# EAGLE design untitled (EAGLE 5.06)
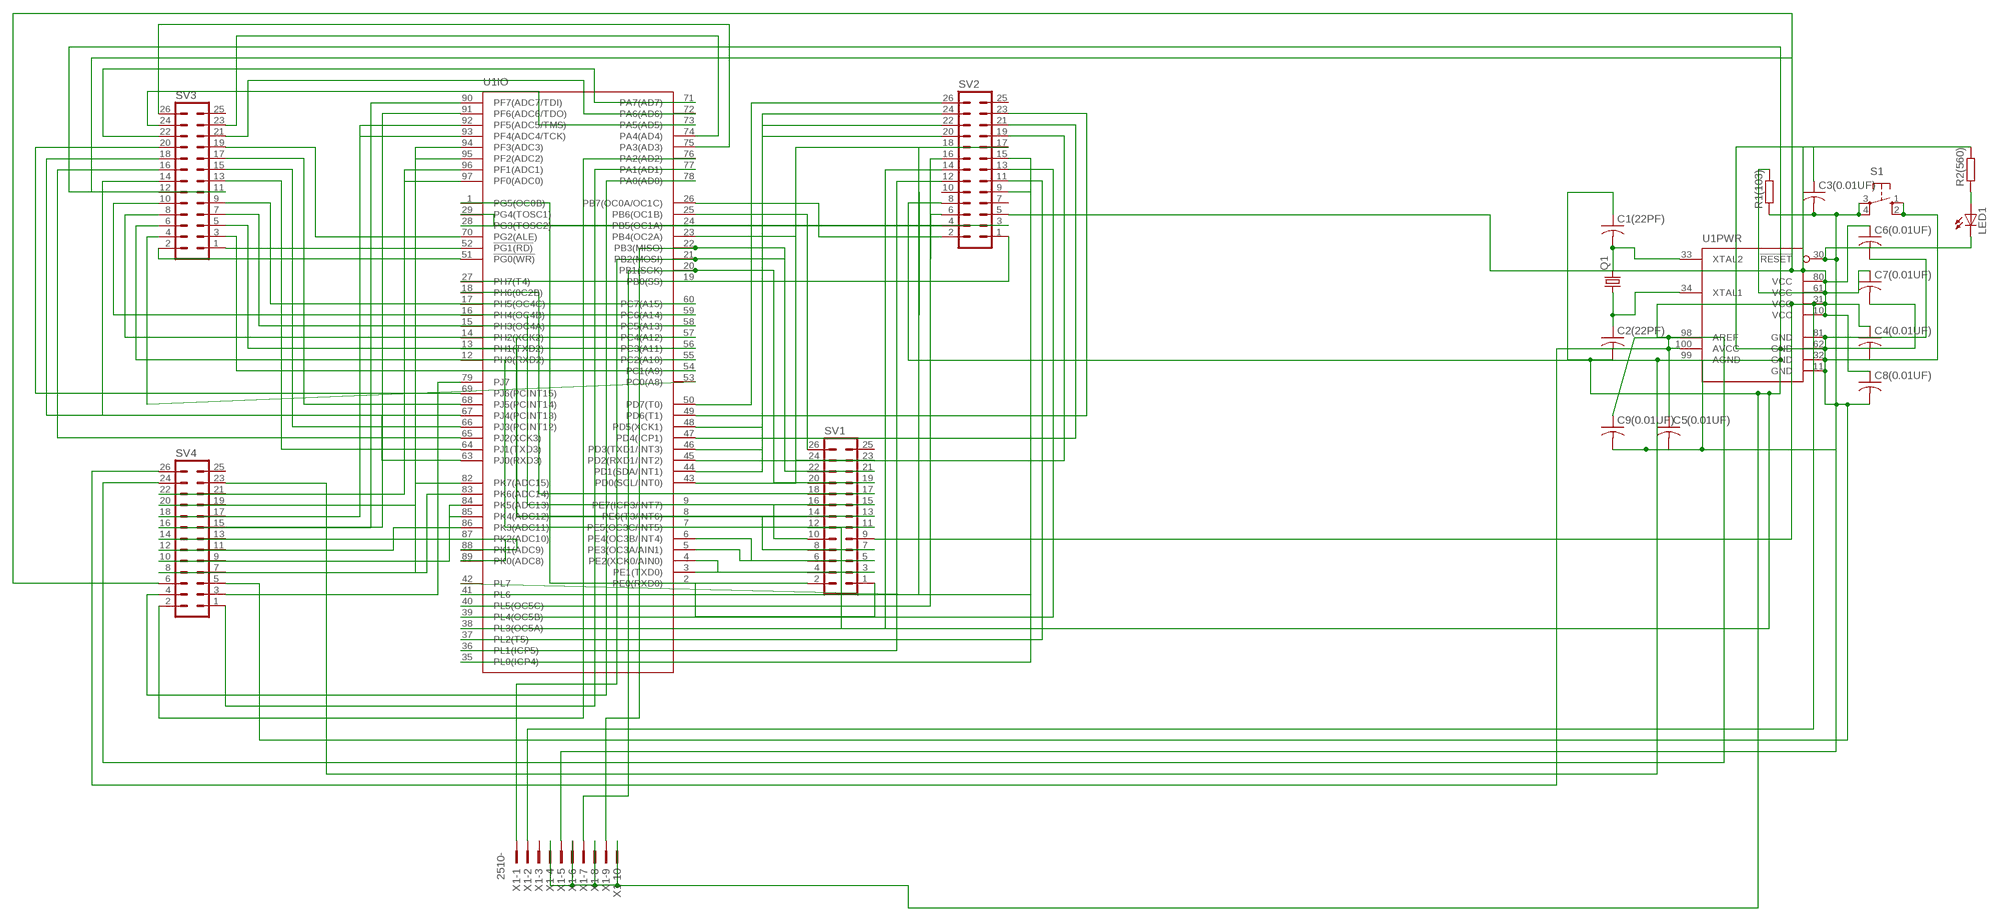
[diagram p0: schematic, sheet 1]

## Parts
C1(22PF)  C-USC0603K  [C0603K]
C2(22PF)  C-USC0603K  [C0603K]
C3(0.01UF)  C-USC0603K  [C0603K]
C4(0.01UF)  C-USC0603K  [C0603K]
C5(0.01UF)  C-USC0603K  [C0603K]
C6(0.01UF)  C-USC0603K  [C0603K]
C7(0.01UF)  C-USC0603K  [C0603K]
C8(0.01UF)  C-USC0603K  [C0603K]
C9(0.01UF)  C-USC0603K  [C0603K]
LED1  LEDCHIPLED_0805  [CHIPLED_0805]
Q1  CRYSTALSM49  [SM49]
R1(103)  R-EU_M2012  [M2012]
R2(560)  R-EU_M2012  [M2012]
S1  10-XX  [B3F-10XX]
SV1  ML26  [ML26]
SV2  ML26  [ML26]
SV3  ML26  [ML26]
SV4  ML26  [ML26]
U1  ATMEGA640  [TQFP100]
X1  2510-  [PAK100/2500-10]

## Nets
N$1: SV3.14 U1.63(IO:PJ0(RXD3))
N$3: C2(22PF).1 Q1.1 U1.34(PWR:XTAL1)
N$5: SV2.16 U1.40(IO:PL5(OC5C))
N$6: SV1.20 U1.19(IO:PB0(SS))
N$7: SV1.1 U1.2(IO:PE0(RXD0))
N$8: SV3.13 U1.64(IO:PJ1(TXD3))
N$9: SV1.3 U1.4(IO:PE2(XCK0/AIN0))
N$10: SV1.4 U1.3(IO:PE1(TXD0))
N$11: SV1.6 U1.5(IO:PE3(OC3A/AIN1))
N$12: SV1.5 U1.6(IO:PE4(OC3B/INT4))
N$13: SV1.8 U1.7(IO:PE5(OC3C/INT5))
N$14: SV1.7 U1.8(IO:PE6(T3/INT6))
N$15: SV1.10 U1.9(IO:PE7(ICP3/INT7))
N$16: SV1.19 U1.20(IO:PB1(SCK)) X1.7
N$17: SV1.11 U1.12(IO:PH0(RXD2))
N$18: SV1.14 U1.13(IO:PH1(TXD2))
N$19: SV1.13 U1.14(IO:PH2(XCK2))
N$20: SV1.16 U1.15(IO:PH3(OC4A))
N$21: SV1.15 U1.16(IO:PH4(OC4B))
N$22: SV1.18 U1.17(IO:PH5(OC4C))
N$23: SV1.17 U1.18(IO:PH6(0C2B))
N$24: SV1.22 U1.21(IO:PB2(MOSI)) X1.1
N$25: SV1.21 U1.22(IO:PB3(MISO)) X1.9
N$26: SV1.24 U1.23(IO:PB4(OC2A))
N$27: SV1.23 U1.24(IO:PB5(OC1A))
N$28: SV1.26 U1.25(IO:PB6(OC1B))
N$29: SV2.2 U1.26(IO:PB7(OC0A/OC1C))
N$30: SV2.1 U1.27(IO:PH7(T4))
N$31: SV2.4 U1.28(IO:PG3(TOSC2))
N$32: SV2.3 U1.29(IO:PG4(TOSC1))
N$33: SV2.6
N$34: SV2.9 U1.35(IO:PL0(ICP4))
N$35: SV2.12 U1.36(IO:PL1(ICP5))
N$36: SV2.11 U1.37(IO:PL2(T5))
N$37: SV2.14 U1.38(IO:PL3(OC5A))
N$38: SV2.13 U1.39(IO:PL4(OC5B))
N$39: SV2.15 U1.41(IO:PL6)
N$40: SV2.18 U1.42(IO:PL7)
N$41: SV2.17 U1.43(IO:PD0(SCL/INT0))
N$42: SV2.20 U1.44(IO:PD1(SDA/INT1))
N$43: SV2.19 U1.45(IO:PD2(RXD1/INT2))
N$44: SV2.22 U1.46(IO:PD3(TXD1/INT3))
N$45: SV2.21 U1.47(IO:PD4(ICP1))
N$46: SV2.24 U1.48(IO:PD5(XCK1))
N$47: SV2.23 U1.49(IO:PD6(T1))
N$48: SV2.26 U1.50(IO:PD7(T0))
N$49: C1(22PF).2 Q1.2 U1.33(PWR:XTAL2)
N$51: SV3.2 U1.51(IO:!PG0(WR))
N$52: SV3.1 U1.52(IO:!PG1(RD))
N$53: SV3.4 U1.53(IO:PC0(A8))
N$54: SV3.3 U1.54(IO:PC1(A9))
N$55: SV3.6 U1.55(IO:PC2(A10))
N$56: SV3.5 U1.56(IO:PC3(A11))
N$57: SV3.8 U1.57(IO:PC4(A12))
N$58: SV3.7 U1.58(IO:PC5(A13))
N$59: SV3.10 U1.59(IO:PC6(A14))
N$60: SV3.9 U1.60(IO:PC7(A15))
N$61: SV4.18 U1.92(IO:PF5(ADC5/TMS))
N$63: SV3.16 U1.65(IO:PJ2(XCK3))
N$64: SV3.15 U1.66(IO:PJ3(PCINT12))
N$65: SV3.18 U1.67(IO:PJ4(PCINT13))
N$66: SV3.17 U1.68(IO:PJ5(PCINT14))
N$67: SV3.20 U1.69(IO:PJ6(PCINT15))
N$68: SV3.19 U1.70(IO:PG2(ALE))
N$69: SV3.22 U1.71(IO:PA7(AD7))
N$70: SV3.21 U1.72(IO:PA6(AD6))
N$71: SV3.24 U1.73(IO:PA5(AD5))
N$72: SV3.23 U1.74(IO:PA4(AD4))
N$73: SV3.26 U1.75(IO:PA3(AD3))
N$74: SV4.2 U1.76(IO:PA2(AD2))
N$75: SV4.1 U1.77(IO:PA1(AD1))
N$76: SV4.4 U1.78(IO:PA0(AD0))
N$77: SV4.3 U1.79(IO:PJ7)
N$79: SV4.19 U1.95(IO:PF2(ADC2))
N$80: SV4.7 U1.83(IO:PK6(ADC14))
N$81: SV4.8 U1.82(IO:PK7(ADC15))
N$82: SV4.9 U1.85(IO:PK4(ADC12))
N$83: SV4.10 U1.84(IO:PK5(ADC13))
N$84: SV4.11 U1.87(IO:PK2(ADC10))
N$85: SV4.12 U1.86(IO:PK3(ADC11))
N$86: SV4.13 U1.89(IO:PK0(ADC8))
N$87: SV4.14 U1.88(IO:PK1(ADC9))
N$88: SV4.15 U1.91(IO:PF6(ADC6/TDO))
N$89: SV4.16 U1.90(IO:PF7(ADC7/TDI))
N$90: SV4.17 U1.93(IO:PF4(ADC4/TCK))
N$91: SV4.20 U1.94(IO:PF3(ADC3))
N$92: SV4.21 U1.97(IO:PF0(ADC0))
N$93: SV4.22 U1.96(IO:PF1(ADC1))
N$94: C4(0.01UF).1 C5(0.01UF).1 C6(0.01UF).1 C7(0.01UF).1 C8(0.01UF).1 C9(0.01UF).1 R1(103).2 R2(560).2 SV1.9 SV2.5 SV3.12 SV4.6 SV4.24 SV4.26 U1.10(PWR:VCC) U1.31(PWR:VCC) U1.61(PWR:VCC) U1.80(PWR:VCC) U1.98(PWR:AREF) U1.100(PWR:AVCC) X1.2
N$95: SV1.2 U1.1(IO:PG5(OC0B))
N$105: C3(0.01UF).2 LED1.C R1(103).1 S1.3(P) S1.4(P1) U1.30(PWR:!RESET) X1.5
N$107: C1(22PF).1 C2(22PF).2 C3(0.01UF).1 C4(0.01UF).2 C5(0.01UF).2 C6(0.01UF).2 C7(0.01UF).2 C8(0.01UF).2 C9(0.01UF).2 S1.1(S) S1.2(S1) SV1.12 SV2.8 SV3.11 SV4.5 SV4.23 U1.11(PWR:GND) U1.32(PWR:GND) U1.62(PWR:GND) U1.81(PWR:GND) U1.99(PWR:AGND) X1.4 X1.6 X1.8 X1.10
N$109: LED1.A R2(560).1
Unconnected: SV1.25 SV2.7 SV2.10 SV2.25 SV3.25 SV4.25 X1.3

## Library data of the parts
C1(22PF) C2(22PF) C3(0.01UF) C4(0.01UF) C5(0.01UF) C6(0.01UF) C7(0.01UF) C8(0.01UF) C9(0.01UF) = adafruit:C-US: CAPACITOR, American symbol
LED1 = adafruit:LED: LED OSRAM: - CHIPLED LG R971, LG N971, LY N971, LG Q971, LY Q971, LO R971, LY R971 LH N974, LH R974 LS Q976, LO Q976, LY Q976 LO Q996 - Hyper CHIPLED LW Q18S LB Q993, LB Q99A, LB R99A - SideLED LS A670, LO A670, LY A670, LG A670, LP A670 LB A673, LV A673, LT A673, LW A673 LH A674 LY A675 LS A676, LA A676, LO A676, LY A676, LW A676 LS A679, LY A679, LG A679 - Hyper Micro SIDELED® LS Y876, LA Y876, LO Y876, LY Y876 LT Y87S - SmartLED LW L88C, LW L88S LB L89C, LB L89S, LG L890 LS L89K, LO L89K, LY L89K LS L896, LA L896, LO L896, LY L896 - TOPLED LS T670, LO T670, LY T670, LG T670, LP T670 LSG T670, LSP T670, LSY T670, LOP T670, LYG T670 LG T671, LOG T671, LSG T671 LB T673, LV T673, LT T673, LW T673 LH T674 LS T676, LA T676, LO T676, LY T676, LB T676, LH T676, LSB T676, LW T676 LB T67C, LV T67C, LT T67C, LS T67K, LO T67K, LY T67K, LW E67C LS E67B, LA E67B, LO E67B, LY E67B, LB E67C, LV E67C, LT E67C LW T67C LS T679, LY T679, LG T679 LS T770, LO T770, LY T770, LG T770, LP T770 LB T773, LV T773, LT T773, LW T773 LH T774 LS E675, LA E675, LY E675, LS T675 LS T776, LA T776, LO T776, LY T776, LB T776 LHGB T686 LT T68C, LB T68C - Hyper Mini TOPLED® LB M676 - Mini TOPLED Santana® LG M470 LS M47K, LO M47K, LY M47K Source: http://www.osram.convergy.de/
Q1 = crystal:CRYSTAL: CRYSTAL
R1(103) R2(560) = resistor:R-EU_: RESISTOR, European symbol
S1 = switch-omron:10-XX: OMRON SWITCH
SV1-SV4 = con-harting-ml:ML26: HARTING
U1 = ATmega640:ATMEGA640
X1 = con-3m:2510-: 3M (TM) Pak 100 4-Wall Header Source: 3M

## Board
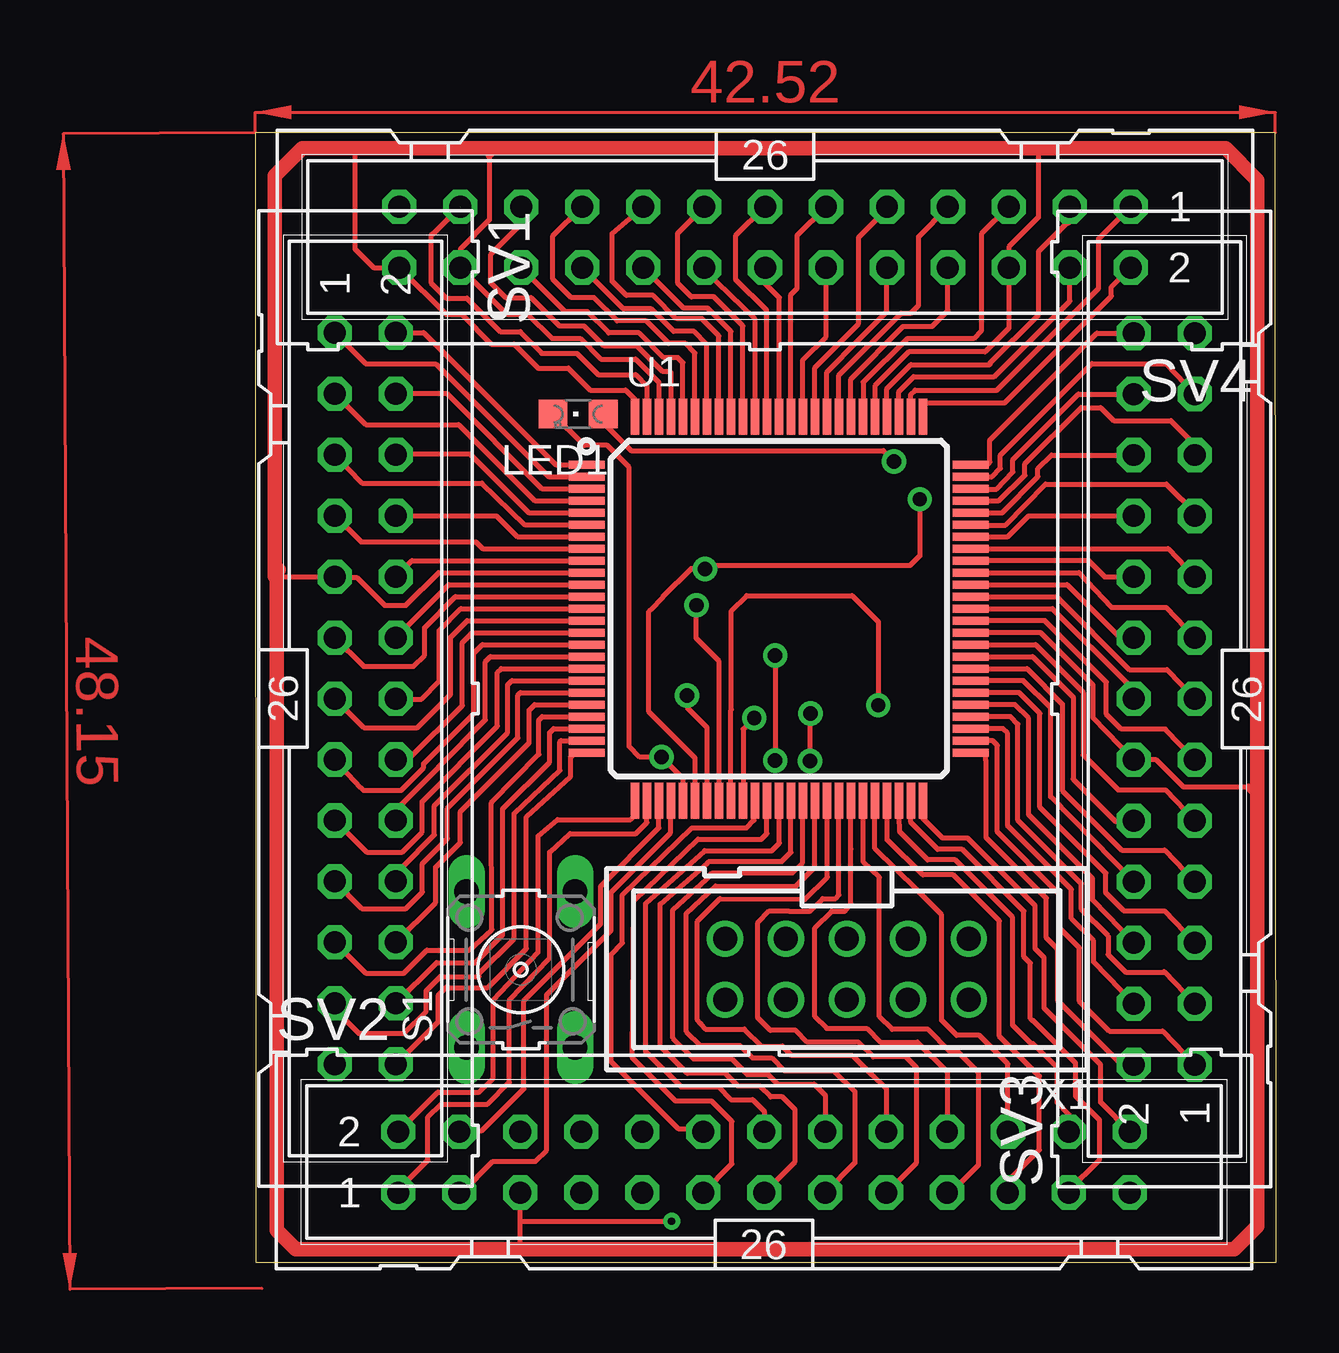
[diagram p1: board, top side]
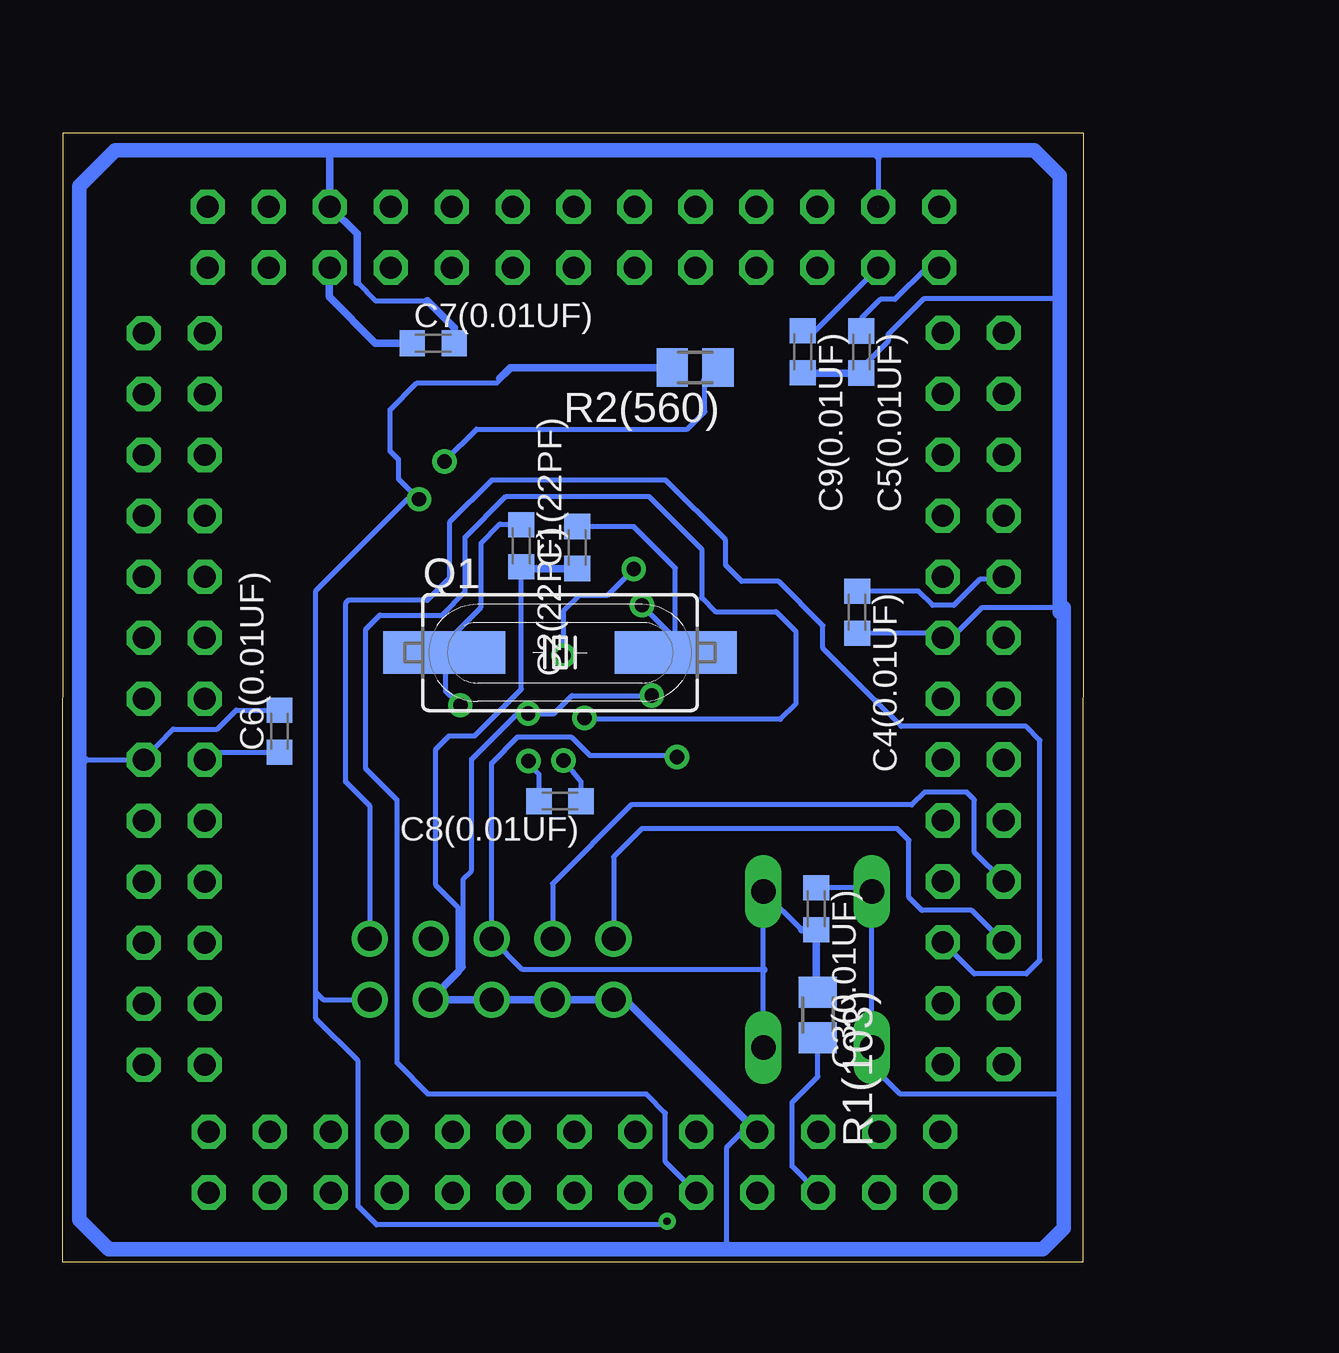
[diagram p2: board, bottom side, seen from below]

Size 42.54 x 47.06 mm. Coordinates in mm from the lower left corner, seen from the top.
Outline: 0.03,0 42.54,0 42.52,47.06 0,47.06 0.03,0
Copper layers (1*16): Top 0.035mm / dielectric 1.5mm / Bottom 0.035mm
Design rules "default": minimum track width 10mil, minimum drill 24mil, track to track 8mil, track to pad 8mil, pad to pad 8mil, via to via 8mil, smd to smd 8mil, copper to edge 40mil, drill to drill 8mil, minimum pad ring 10mil, minimum via ring 8mil, stop-mask expansion 4mil, vias tented up to drill 0mil, thermal gap 10mil

### Footprints (pad centres in the part's own frame; a part is rotated, then mirrored left to right if it is on the bottom)
C0603K = smd 1.05 x 1.08: 1 -0.875,0; 2 0.875,0
CHIPLED_0805 = smd 1.2 x 1.2: A 0,-1.05; C 0,1.05
SM49 = smd 5.08 x 1.778: 1 -4.826,0; 2 4.826,0
M2012 = smd 1.3 x 1.6: 1 -0.95,0; 2 0.95,0
B3F-10XX = drill 1.016 long: 1 -3.251,2.261; 2 3.251,2.261; 3 -3.251,-2.261; 4 3.251,-2.261
ML26 = drill 0.914 octagon: 1 -15.24,-1.27; 2 -15.24,1.27; 3 -12.7,-1.27; 4 -12.7,1.27; 5 -10.16,-1.27; 6 -10.16,1.27; 7 -7.62,-1.27; 8 -7.62,1.27; 9 -5.08,-1.27; 10 -5.08,1.27; 11 -2.54,-1.27; 12 -2.54,1.27; 13 0,-1.27; 14 0,1.27; 15 2.54,-1.27; 16 2.54,1.27; 17 5.08,-1.27; 18 5.08,1.27; 19 7.62,-1.27; 20 7.62,1.27; 21 10.16,-1.27; 22 10.16,1.27; 23 12.7,-1.27; 24 12.7,1.27; 25 15.24,-1.27; 26 15.24,1.27
TQFP100 = smd 1.5 x 0.35: 1 -8,6; 2 -8,5.5; 3 -8,5; 4 -8,4.5; 5 -8,4; 6 -8,3.5; 7 -8,3; 8 -8,2.5; 9 -8,2; 10 -8,1.5; 11 -8,1; 12 -8,0.5; 13 -8,0; 14 -8,-0.5; 15 -8,-1; 16 -8,-1.5; 17 -8,-2; 18 -8,-2.5; 19 -8,-3; 20 -8,-3.5; 21 -8,-4; 22 -8,-4.5; 23 -8,-5; 24 -8,-5.5; 25 -8,-6; 51 8,-6; 52 8,-5.5; 53 8,-5; 54 8,-4.5; 55 8,-4; 56 8,-3.5; 57 8,-3; 58 8,-2.5; 59 8,-2; 60 8,-1.5; 61 8,-1; 62 8,-0.5; 63 8,0; 64 8,0.5; 65 8,1; 66 8,1.5; 67 8,2; 68 8,2.5; 69 8,3; 70 8,3.5; 71 8,4; 72 8,4.5; 73 8,5; 74 8,5.5; 75 8,6 | smd 0.35 x 1.5: 26 -6,-8; 27 -5.5,-8; 28 -5,-8; 29 -4.5,-8; 30 -4,-8; 31 -3.5,-8; 32 -3,-8; 33 -2.5,-8; 34 -2,-8; 35 -1.5,-8; 36 -1,-8; 37 -0.5,-8; 38 0,-8; 39 0.5,-8; 40 1,-8; 41 1.5,-8; 42 2,-8; 43 2.5,-8; 44 3,-8; 45 3.5,-8; 46 4,-8; 47 4.5,-8; 48 5,-8; 49 5.5,-8; 50 6,-8; 76 6,8; 77 5.5,8; 78 5,8; 79 4.5,8; 80 4,8; 81 3.5,8; 82 3,8; 83 2.5,8; 84 2,8; 85 1.5,8; 86 1,8; 87 0.5,8; 88 0,8; 89 -0.5,8; 90 -1,8; 91 -1.5,8; 92 -2,8; 93 -2.5,8; 94 -3,8; 95 -3.5,8; 96 -4,8; 97 -4.5,8; 98 -5,8; 99 -5.5,8; 100 -6,8
PAK100/2500-10 = drill 1 pad 1.422: 1 -5.08,-1.27; 2 -5.08,1.27; 3 -2.54,-1.27; 4 -2.54,1.27; 5 0,-1.27; 6 0,1.27; 7 2.54,-1.27; 8 2.54,1.27; 9 5.08,-1.27; 10 5.08,1.27

### Placement (x,y rotation side)
C1(22PF)  21.09,29.78 90 bottom
C2(22PF)  23.42,29.85 270 bottom
C3(0.01UF)  11.14,14.73 270 bottom
C4(0.01UF)  9.43,27.09 270 bottom
C5(0.01UF)  9.25,37.92 270 bottom
C6(0.01UF)  33.5,22.13 90 bottom
C7(0.01UF)  27.09,38.29 0 bottom
C8(0.01UF)  21.81,19.21 180 bottom
C9(0.01UF)  11.69,37.93 270 bottom
LED1  13.46,35.34 90 top
Q1  21.81,25.4 0 bottom
R1(103)  11.07,10.3 270 bottom
R2(560)  16.18,37.28 180 bottom
S1  11.08,12.19 90 top
SV1  4.59,23.48 270 top
SV2  21.21,4.17 0 top
SV3  37.88,23.47 90 top
SV4  21.25,42.71 180 top
U1  21.83,27.23 0 top
X1  24.66,12.21 180 top

### Tracks (layer width: path | path; a pad name or v marks a point on that pad's centre or on a via)
N$1
  Top 0.203: U1.63 33.22,27.23 36.35,24.09 36.35,23.79 SV3.14
N$3  (via drill 0.6 pad 1.02)
  Top 0.203: U1.34 19.83,23.01 19.84,23.02 19.84,27.14 20.48,27.78 24.87,27.78 25.97,26.68 v25.97,23.21
  Top 0.305: U1.34
  Bottom 0.203: v25.97,23.21 26.4,23.64 26.43,23.64 26.58,23.8 26.58,25.46 26.58,25.82 25.1,27.29 25.1,29.96 24.31,30.75 23.44,30.75 C2(22PF).1
  Bottom 0.305: 26.58,25.46 Q1.1
N$5
  Top 0.203: SV2.16 23.75,6.96 23.29,7.42 21.78,7.42 21.37,7.83 20.5,7.83 19.86,8.47 18.27,8.47 17.41,9.34 17.41,14.69 18.82,15.98 | 18.82,15.98 19.04,16.18 | 22.81,19.1 22.81,16.65 22.38,16.22 19.05,16.22 18.82,15.98
  Top 0.305: 22.81,19.1 U1.40
N$6
  Top 0.203: U1.19 10.69,24.23 10.52,24.05 10.52,22.07 7.47,19.02 7.47,17.81 6.09,16.42 6.09,16.09 SV1.20
N$7
  Top 0.203: 3.32,38.67 SV1.1 4.61,37.43 7.52,37.43 12.23,32.73 U1.2
N$8
  Top 0.203: U1.64 33.4,27.73 36.43,24.69 37.99,24.69 SV3.13
N$9
  Top 0.203: U1.4 11.65,31.73 8.48,34.9 4.61,34.9 SV1.3
N$10
  Top 0.203: U1.3 11.95,32.23 7.98,36.2 5.88,36.2 SV1.4
N$11
  Top 0.203: U1.5 11.4,31.23 8.95,33.68 5.9,33.68 SV1.6
N$12
  Top 0.203: U1.6 11.23,30.73 9.45,32.46 4.46,32.46 SV1.5
N$13
  Top 0.203: U1.7 10.93,30.23 10.06,31.1 SV1.8
N$14
  Top 0.203: U1.8 9.48,29.73 9.2,30.01 4.42,30.01 SV1.7
N$15
  Top 0.203: U1.9 6.53,29.23 SV1.10
N$16
  Top 0.203: U1.20 11.06,23.73 10.95,23.62 10.95,21.85 8.01,18.91 8.01,17.65 6.97,16.6 6.97,15.42 6.28,14.73 4.45,14.73 SV1.19
  Bottom 0.203: X1.7 22.12,15.78 18.85,19.05 7.15,19.05 6.62,19.58 4.86,19.58 4.54,19.27 4.54,17.09 SV1.19
N$17
  Top 0.203: U1.12 8.34,27.73 7.06,26.44 7.06,25.29 6.6,24.83 4.52,24.83 SV1.11
N$18
  Top 0.203: U1.13 8.58,27.23 7.67,26.32 7.67,24.2 6.93,23.46 5.88,23.46 SV1.14
N$19
  Top 0.203: U1.14 8.83,26.73 8.15,26.05 8.15,23.65 6.77,22.27 4.54,22.27 SV1.13
  Top 0.305: SV1.13
N$20
  Top 0.203: U1.15 9.04,26.23 8.63,25.81 8.63,23.19 6.43,20.99 5.91,20.99 SV1.16
N$21
  Top 0.203: U1.16 9.47,25.73 9.11,25.37 9.11,22.86 7.03,20.77 7.03,20.6 6.09,19.66 4.52,19.66 4.43,19.75 SV1.15
N$22
  Top 0.203: U1.17 9.81,25.23 9.6,25.02 9.6,22.6 7.64,20.64 7.64,20.62 5.94,18.92 5.94,18.48 SV1.18 5.98,18.52
N$23
  Top 0.203: U1.18 10.25,24.73 10.1,24.58 10.1,22.33 6.96,19.19 6.96,17.91 6.13,17.08 4.64,17.08 SV1.17
N$24
  Top 0.203: U1.21 11.65,23.23 11.42,23 11.42,21.64 8.55,18.77 8.55,17.49 7.53,16.46 7.53,14.99 SV1.22
  Bottom 0.203: SV1.22 4.55,12.01 2.38,12.01 1.81,12.58 1.81,21.75 2.39,22.32 7.6,22.32 8.61,23.34 10.85,25.58 10.85,26.52 12.7,28.37 14.24,28.37 14.92,29.05 14.92,30.09 17.41,32.59 24.66,32.59 26.42,30.82 26.42,28.49 27.34,27.57 30.63,27.57 30.76,27.45 30.76,20.03 29.74,19.02 X1.1
  Bottom 0.305: 8.61,23.34
N$25
  Top 0.203: U1.22 11.96,22.73 11.82,22.59 11.82,21.16 9.84,19.14 9.86,13.86 8.92,13 7.16,13 6.2,12.04 4.6,12.04 SV1.21
  Bottom 0.203: X1.9 19.58,16.89 18.4,18.07 7.75,18.07 7.28,17.59 7.28,15.2 6.74,14.66 4.66,14.66 SV1.21
N$26
  Top 0.203: U1.23 12.44,22.23 12.27,22.06 12.27,20.84 10.31,18.89 10.31,13.63 9.18,12.49 7.57,12.49 SV1.24
N$27
  Top 0.203: SV1.23 3.27,10.58 4.31,9.54 6.2,9.54 7.12,10.45 7.12,11.31 7.71,11.9 9.33,11.9 9.33,12.01 10.8,13.48 10.8,18.7 12.7,20.49 12.7,21.68 12.74,21.73 U1.24
N$28
  Top 0.203: U1.25 13.33,21.23 13.14,21.04 13.14,20.24 11.31,18.55 11.31,13.06 9.68,11.45 7.98,11.45 7.97,11.46 7.64,11.13 7.64,10.02 SV1.26
N$29
  Top 0.203: U1.26 15.83,18.62 15.65,18.44 12.6,18.44 11.8,17.77 11.8,12.91 9.91,10.91 9.91,7.67 9.33,7.08 7.61,7.08 SV2.2
N$30
  Top 0.203: SV2.1 5.97,3.01 7.2,4.24 7.2,6.05 7.74,6.59 9.68,6.59 10.59,7.5 10.59,10.92 12.27,12.67 12.27,17.08 13.11,17.85 15.87,17.85 16.33,18.32 U1.27
N$31
  Top 0.203: U1.28 16.83,18.09 14.39,15.66 14.39,14.09 12.86,12.56 | SV2.4 8.55,5.48 9.45,5.48 11.19,7.23 11.19,10.89 12.86,12.56 | 12.86,12.56
N$32
  Top 0.203: SV2.3 8.61,2.9 9.91,4.2 11.67,4.2 12.15,4.67 12.15,11.13 14.84,13.82 14.84,15.42 17.32,17.9 U1.29
  Top 0.305: U1.29
N$34  (via drill 0.6 pad 1.02)
  Top 0.203: 20.34,19.25 20.34,22.21 v20.8,22.68
  Top 0.305: 20.34,19.25 U1.35
  Bottom 0.203: v20.8,22.68 20.74,22.62 12.63,22.62 12,23.25 12,26.29 12.81,27.11 15.34,27.11 15.91,27.68 15.91,29.71 18.11,31.91 24.06,31.91 25.76,30.21 25.76,27.93 26.73,26.96 29.32,26.96 29.9,26.38 29.9,20.55 28.6,19.25 28.6,8.3 27.3,7 18.21,7 17.42,6.21 17.42,4.19 SV2.9
N$35
  Top 0.203: SV2.12 18.55,5.56 17.62,5.56 14.83,8.36 14.83,12.82 15.3,13.29 15.3,15.31 18.2,18.09 18.21,18.1 20.48,18.1 20.78,18.4 20.78,19.18 U1.36
N$36
  Top 0.203: SV2.11 19.87,4.1 19.87,5.86 19.02,6.71 17.52,6.71 15.72,8.52 15.77,15.06 18.45,17.63 18.47,17.62 21.09,17.62 21.33,17.86 U1.37
N$37
  Top 0.203: SV2.14 21.21,6.29 20.73,6.78 19.82,6.78 19.29,7.3 17.75,7.3 16.28,8.77 16.28,14.96 18.73,17.15 18.74,17.13 21.52,17.13 21.85,17.46 21.85,19.2
  Top 0.305: 21.85,19.2 U1.38
N$38
  Top 0.203: SV2.13 22.5,4.19 22.5,6.36 21.97,6.89 21.48,6.89 21.03,7.34 20.12,7.34 19.59,7.87 18.01,7.87 16.88,9 16.88,14.92 18.86,16.65 18.9,16.7 21.95,16.7 22.33,17.08 U1.39
N$39
  Top 0.203: SV2.15 24.99,4.14 24.99,7.11 24.12,7.98 22.05,7.98 21.52,8.51 20.73,8.51 20.2,9.04 18.54,9.04 17.97,9.6 17.97,14.54 19.18,15.67 22.54,15.67 23.33,16.46 U1.41
N$40
  Top 0.203: SV2.18 26.29,7.24 25.7,7.83 25.67,7.83 24.87,8.62 22.35,8.62 21.97,9 21.1,9 20.39,9.71 18.76,9.71 18.58,9.9 18.58,9.94 18.43,10.09 18.43,14.2 19.37,15.14 22.72,15.11 22.91,15.11 23.85,16.05 23.85,19.2
  Top 0.305: 23.85,19.2 U1.42
N$41
  Top 0.203: SV2.17 26.31,2.9 27.56,4.15 27.56,8.1 27.11,8.55 25.75,8.55 25.13,9.17 23.02,9.17 22.53,9.65 21.47,9.65 20.95,10.18 20.95,14.15 21.43,14.63 22.22,14.63 22.23,14.62 23.12,14.62 23.64,15.14 24.19,15.14 24.32,15.3 U1.43
  Top 0.305: U1.43
N$42
  Top 0.203: 24.81,19.21 24.81,17.27 24.82,17.21 24.82,14.93 24.59,14.62 24.02,14.62 23.32,13.93 23.32,10.23 23.81,9.74 25.48,9.74 26.06,9.17 27.6,9.17 28.83,7.94 SV2.20
  Top 0.305: 24.81,19.21 U1.44
N$43
  Top 0.203: SV2.19 28.99,2.9 30.14,4.05 30.14,7.89 29.25,8.79 28.95,8.79 28.04,9.7 26.54,9.7 26.01,10.23 26.01,16.03 25.34,16.67 25.34,19.18
  Top 0.305: 25.34,19.18 U1.45
N$44
  Top 0.203: SV2.22 31.37,8.26 30.18,9.45 29.23,9.45 28.61,10.07 28.61,14.47 27.56,15.51 25.82,17.23 U1.46
  Top 0.305: U1.46
N$45
  Top 0.203: SV2.21 31.37,3.37 32.68,4.68 32.68,7.75 31.01,9.42 31.01,14.22 29.08,16.14 27.82,16.14 26.33,17.6 26.33,19.19
  Top 0.305: 26.33,19.19 U1.47
N$46
  Top 0.203: SV2.24 33.91,6.16 33.41,6.66 33.41,8.1 32.41,9.11 32.34,9.11 31.57,9.88 31.57,11.76 31.57,14.37 29.17,16.76 28.02,16.76 26.87,17.93 U1.48
  Top 0.305: U1.48
N$47
  Top 0.203: SV2.23 33.91,2.99 35.19,4.27 35.19,5.92 34.19,6.92 34.19,8.3 32.41,10.08 32.37,10.08 32.31,10.14 32.31,12.46 32.04,12.73 32.04,14.63 29.46,17.21 28.44,17.21 27.33,18.32 27.33,19.04
  Top 0.305: 27.33,19.04 U1.49
N$48
  Top 0.203: SV2.26 35.23,6.66 35.23,8.23 32.88,10.58 32.88,12.69 32.5,13.07 32.5,14.86 29.69,17.67 28.65,17.67 27.83,18.49 U1.50
N$49  (via drill 0.6 pad 1.02)
  Top 0.203: U1.33 19.34,19.25 19.34,25.03 18.37,26 18.37,27.34 v18.4,27.37
  Bottom 0.203: C1(22PF).2 18.74,30.65 17.01,28.92 17.01,25.42 | Q1.2 16.99,25.96 v18.4,27.37
  Bottom 0.305: Q1.2 17.01,25.42
N$51
  Top 0.203: SV3.2 36.11,8.23 33.45,10.89 33.45,13.04 32.97,13.51 32.97,15.17 30.45,17.69 30.45,20.9 30.44,20.92 30.44,21.12 30.36,21.2 29.86,21.2 U1.51
N$52
  Top 0.203: U1.52 30.73,21.73 30.92,21.53 30.92,17.93 33.49,15.36 33.49,13.95 34.34,13.1 34.34,10.88 35.59,9.63 37.82,9.63 SV3.1
N$53
  Top 0.203: SV3.4 34.94,12.5 34.94,13.39 34.01,14.31 34.01,15.54 31.34,18.21 31.35,18.22 31.35,22.04 31.16,22.23 U1.53
N$54
  Top 0.203: U1.54 31.48,22.73 31.78,22.42 31.78,18.42 34.43,15.77 34.43,14.71 35.54,13.6 35.54,12.81 36.27,12.08 37.85,12.08 37.88,12.11 SV3.3
N$55
  Top 0.203: U1.55 31.66,23.23 32.23,22.66 32.23,18.65 34.9,15.98 34.9,15.09 SV3.6
N$56
  Top 0.203: U1.56 31.84,23.73 32.7,22.87 32.7,18.96 35.45,16.21 35.45,15.39 36.2,14.64 37.88,14.64 SV3.5
N$57
  Top 0.203: U1.57 32.02,24.23 33.14,23.1 33.14,19.38 SV3.8
N$58
  Top 0.203: U1.58 32.17,24.73 33.64,23.26 33.64,19.65 36.12,17.17 37.89,17.17 SV3.7
N$59
  Top 0.203: U1.59 32.4,25.23 34.08,23.55 34.08,20.12 35.83,18.38 36.65,18.38 SV3.10
N$60
  Top 0.203: U1.60 32.53,25.73 34.5,23.75 34.5,21.14 35.96,19.68 37.92,19.68 SV3.9
N$61
  Top 0.203: U1.92 19.82,38.78 18.85,39.75 17.86,39.75 SV4.18
  Top 0.305: U1.92
N$63
  Top 0.203: U1.65 33.84,28.23 36.09,25.97 36.63,25.97 SV3.16
N$64
  Top 0.203: U1.66 34.32,28.73 35.67,27.28 37.95,27.28 SV3.15
N$65
  Top 0.203: SV3.18 35.39,28.55 34.71,29.24 29.84,29.24
  Top 0.305: U1.67 29.84,29.24
N$66
  Top 0.203: U1.68 38.04,29.73 SV3.17
N$67
  Top 0.203: SV3.20 32.23,31.09 31.37,30.24 29.83,30.24
  Top 0.305: U1.69 29.83,30.24
N$68
  Top 0.203: SV3.19 39.21,31.18 37.97,32.42 32.93,32.42 31.27,30.71 29.86,30.71
  Top 0.305: U1.70 29.86,30.71
N$69
  Top 0.203: SV3.22 33.18,33.63 32.62,33.08 32.62,32.73 31.12,31.22 29.85,31.22
  Top 0.305: U1.71 29.85,31.22
N$70
  Top 0.203: SV3.21 39.21,34 38.15,35.06 35.78,35.06 35.23,35.61 34.42,35.61 32.07,33.26 32.07,32.79 30.99,31.73 29.82,31.73
  Top 0.305: U1.72 29.82,31.73
N$71
  Top 0.203: SV3.24 34.31,36.17 31.58,33.44 31.58,32.92 30.9,32.21 29.84,32.21
  Top 0.305: U1.73 29.84,32.21
N$72
  Top 0.203: U1.74 30.71,32.73 31.05,33.08 31.05,33.63 34.55,37.12 34.86,37.44 37.95,37.44 SV3.23
N$73
  Top 0.203: SV3.26 35.07,38.71 30.61,34.25 30.61,33.34 30.46,33.19 29.87,33.19 U1.75
N$74
  Top 0.203: 27.83,35.66 27.97,35.81 31.23,35.81 35.68,40.25 35.68,40.63 SV4.2
  Top 0.305: U1.76 27.83,35.66
N$75
  Top 0.203: U1.77 27.33,36.16 27.5,36.34 30.91,36.34 35.15,40.58 35.15,42.64 SV4.1
N$76
  Top 0.203: SV4.4 33.95,40.05 30.8,36.9 27.44,36.9 26.82,36.28 U1.78
  Top 0.305: U1.78
N$77
  Top 0.203: 33.91,43.98 SV4.3 33.95,43.42 33.88,43.35 32.65,42.11 32.65,39.49 30.62,37.46 30.62,37.4 27.32,37.4 26.32,36.4 U1.79
  Top 0.305: U1.79 | 33.88,43.35
N$79
  Top 0.203: U1.95 18.33,37.89 17.94,38.28 17.23,38.28 16.29,39.22 15.09,39.22 14.11,40.19 13.17,40.19 12.41,40.96 12.41,42.76 SV4.19
N$80
  Top 0.203: SV4.7 28.87,43.95 27.65,42.73 27.65,39.87 27.32,39.55 26.91,39.55 24.32,36.95 U1.83
  Top 0.305: U1.83
N$81
  Top 0.203: SV4.8 28.87,39.65 28.21,38.99 27,38.99 24.82,36.78 24.82,35.26
  Top 0.305: U1.82 24.82,35.26
N$82
  Top 0.203: SV4.9 26.33,43.88 25.15,42.7 25.15,39.1 23.33,37.27 23.33,35.28
  Top 0.305: U1.85 23.33,35.28
N$83
  Top 0.203: SV4.10 26.33,39.61 25.18,38.46 23.83,37.07 23.83,35.26 U1.84
N$84
  Top 0.203: U1.87 22.33,40.32 22.59,40.58 22.59,42.78 SV4.11
N$85
  Top 0.203: SV4.12 23.79,38.57 22.82,37.6 U1.86
  Top 0.305: U1.86
N$86
  Top 0.203: SV4.13 21.23,43.98 20.03,42.79 20.03,40.93 21.32,39.66 21.32,35.26
  Top 0.305: U1.89 21.32,35.26
N$87
  Top 0.203: SV4.14 21.25,40.77 21.85,40.19 21.85,35.23
  Top 0.305: U1.88 21.85,35.23
N$88
  Top 0.203: U1.91 20.32,39.02 19.12,40.22 18.17,40.22 17.62,40.78 17.62,42.9 17.63,42.9 SV4.15
  Top 0.305: U1.91
N$89
  Top 0.203: SV4.16 18.71,41.34 20.83,39.28 20.83,35.29
  Top 0.305: U1.90 20.83,35.29
N$90
  Top 0.203: SV4.17 14.88,42.87 14.88,40.87 15.47,40.28 16.59,40.28 17.56,39.31 18.62,39.31 19.33,38.6 U1.93
N$91
  Top 0.203: U1.94 18.83,38.24 18.29,38.78 17.44,38.78 16.5,39.72 15.35,39.72 SV4.20
N$92
  Top 0.203: U1.97 17.33,37.06 17.26,37.13 16.97,37.13 15.91,38.19 14.53,38.19 13.7,39.02 12.67,39.02 11.5,40.19 10.44,40.19 9.82,40.81 9.82,41.99 10.55,42.72 | 10.55,42.72 | 10.55,42.72 11.11,43.28 11.11,43.96
  Top 0.305: 11.11,43.96 SV4.21
N$93
  Top 0.203: U1.96 17.83,37.48 17.62,37.69 17.03,37.69 16,38.72 14.73,38.72 13.85,39.6 12.93,39.6 SV4.22
N$94  (via drill 0.3 pad 0.41, 0.6 pad 1.02)
  Top 0.203: U1.10 7.64,28.73 6.28,27.37 5.4,27.37 4.23,28.53 3.35,28.53 SV1.9 0.84,28.56 | U1.80 25.82,36.51 27.24,37.93 30.41,37.93 31.41,38.92 SV4.6 31.41,42.3 32.63,43.53 32.63,46.32 | U1.100 15.83,35.95 15.44,36.34 13.97,36.34 13.05,37.25 11.79,37.25 10.79,38.25 9.85,38.25 8.61,39.49 7.96,39.49 SV4.26 4.94,41.44 4.16,42.22 4.16,46.38 | U1.61 32.73,26.23 34.92,24.04 34.92,22.69 SV3.12 37.55,20.93 38.68,19.8 41.37,19.8 | 9.76,46.12 9.76,43.43 8.55,42.21 8.59,42.17 8.59,41.4 | 11.05,0.65 11.05,1.71 | 11.05,1.71 SV2.5 | U1.31 18.33,21.01 16.38,22.96 16.38,27.09 16.47,27.18 16.48,27.18 16.97,27.68 16.97,27.7 18.17,28.89 18.73,28.89 v18.74,28.88 18.88,29.02 27.29,29.02 27.69,29.43 v27.69,31.79 | 11.05,1.71 v17.35,1.71 | v21.67,25.28 v21.67,20.91 | U1.98 16.83,36.65 15.85,37.63 14.41,37.63 13.55,38.5 12.38,38.5 11.37,39.5 10.49,39.5 SV4.24 8.59,41.4 | 8.59,41.4 8.56,41.4
  Top 0.305: U1.80 | 4.19,46.41 4.16,46.38 | 10.05,46.41 9.76,46.12 | 41.76,19.4 41.37,19.8 | 32.72,46.41 32.63,46.32 | 11.17,0.53 11.05,0.65
  Top 0.61: 0.84,28.56 0.81,28.59 0.81,45.27 1.96,46.41 4.19,46.41 10.05,46.41 32.72,46.41 40.44,46.41 41.76,45.09 41.76,19.4 41.76,1.5 40.79,0.53 11.17,0.53 1.7,0.53 0.9,1.32 0.9,28.77 0.99,28.85
  Bottom 0.203: C5(0.01UF).1 9.25,39.32 8.46,40.11 7.86,40.11 6.55,41.42 6.03,41.42 | C4(0.01UF).1 6.88,27.96 6.28,27.37 5.4,27.37 4.32,28.45 3.44,28.45 | 29.46,38.29 31.41,40.24 | C6(0.01UF).1 36.35,21.25 SV3.12 | SV2.5 12.14,3.99 12.14,6.66 11.07,7.73 R1(103).2 | SV4.6 31.41,40.2 | 31.99,11.25 31.99,10.14 30.23,8.38 30.23,2.33 29.45,1.55 17.5,1.55 v17.35,1.71 | 31.99,11.25 31.99,27.97 28.17,31.79 v27.69,31.79 28.53,32.63 28.53,33.44 28.89,33.8 28.89,35.53 27.78,36.64 24.44,36.64 23.8,37.28 R2(560).2 | X1.2 31.67,10.94 31.99,11.25 | C8(0.01UF).1 20.94,20.03 v21.67,20.91 | 18.78,28.84 v18.74,28.88 19.84,27.78 21.01,27.78 21.67,27.12 v21.67,25.28 | 8.59,41.4 8.79,41.2 | 11.19,38.81 C9(0.01UF).1 | SV4.24 8.59,41.4 | 8.59,41.4 11.19,38.81 | 11.19,38.81 11.18,38.81 10.07,39.92
  Bottom 0.305: SV4.26 6.03,41.42 | SV1.9 3.44,28.45 | 29.46,38.29 C7(0.01UF).1 29.5,38.29 31.41,40.2 | R2(560).2 23.88,37.28 24.32,36.84
N$95
  Top 0.203: U1.1 12.52,33.23 7.02,38.73 SV1.2
N$104
  Bottom 0.305: 31.43,40.26 31.43,41.49
N$105  (via drill 0.6 pad 1.02)
  Top 0.203: U1.30 17.83,20.16 v16.94,21.05 16.03,21.05 15.59,21.49 15.59,33.12 14.68,34.03 13.72,34.03 LED1.C
  Bottom 0.203: 11.75,13.85 S1.4 13.34,12.19 | 17.23,21.05 v16.94,21.05 17.02,21.12 20.58,21.12 21.34,21.88 23.58,21.88 24.66,20.8 X1.5 | S1.3 13.34,12.19 | 13.34,12.19 23.38,12.19 X1.5
  Bottom 0.305: X1.5 | R1(103).1 11.14,11.87 C3(0.01UF).2 11.75,13.85 | 13.34,12.19 13.32,12.18
N$107  (via drill 0.6 pad 1.02, 0.9 pad 1.02)  (1 unrouted)
  Top 0.203: U1.11 8.07,28.23 SV1.12 | SV4.5 30.27,42.84 30.27,38.81 29.94,38.49 27.18,38.49 25.33,36.66 25.33,35.27 | U1.99 16.33,36.51 15.85,36.98 14.29,36.98 13.41,37.87 11.94,37.87 11.94,37.89 11.06,38.77 10.22,38.77 8.82,40.17 7.97,40.17 7.33,40.81 7.33,42.8 7.38,42.85 7.42,42.85 v8.55,43.98 | U1.62 32.91,26.73 35.46,24.17 35.46,22.84 36.09,22.21 37.93,22.21 SV3.11 | U1.32 18.83,22.29 17.99,23.12 v17.99,23.61 | v23.12,20.89 23.12,22.84 v23.13,22.86
  Top 0.305: 25.33,35.27 U1.81
  Bottom 0.203: 1.17,27.27 4.25,27.27 5.49,26.02 SV1.12 6.05,26.21 C4(0.01UF).2 | C6(0.01UF).2 35.3,23 36.09,22.21 37.93,22.21 SV3.11 41.59,20.93 | 27.35,40.06 29.5,40.06 30.27,40.83 | 14.86,0.74 14.86,4.79 14.22,5.44 SV2.8 | 0.81,7 7.63,7 8.81,8.19 S1.1 S1.2 8.98,15.6 C3(0.01UF).1 | C2(22PF).2 23.42,23.88 25.37,21.93 26.44,21.93 26.99,21.38 26.99,15.71 26.04,14.76 26.04,12.09 | 8.55,46.05 v8.55,43.98 | X1.4 25.84,12.29 25.84,15.97 25.49,16.32 25.49,20.96 23.65,22.8 23.19,22.8 v23.13,22.86 22.07,22.86 21.32,23.61 v17.99,23.61 | v23.12,20.89 23.12,20.76 22.69,20.34 C8(0.01UF).2 | C9(0.01UF).2 9.45,37.06 8.14,38.37 8.14,38.66 6.66,40.13 1.17,40.13
  Bottom 0.305: C5(0.01UF).2 11.69,37.05 C9(0.01UF).2 | 0.99,27.09 1.17,27.27 | 0.99,40.31 1.17,40.13 | C7(0.01UF).2 26.22,38.93 27.35,40.06 | 41.85,20.68 41.59,20.93 | 31.54,46.32 31.41,46.19 SV4.5 30.27,42.84 30.27,40.83 | 14.65,0.53 14.86,0.74 | C1(22PF).1 23.35,28.9 C2(22PF).2 | 26.04,12.09 X1.4 X1.6 X1.8 X1.10 19.08,10.94 SV2.8 | 8.82,46.32 8.55,46.05
  Bottom 0.61: 0.99,27.09 0.99,40.31 0.99,45.27 2.05,46.32 8.82,46.32 31.54,46.32 40.35,46.32 41.85,44.82 41.85,20.68 41.85,1.76 40.62,0.53 14.65,0.53 1.7,0.53 0.81,1.41 0.81,7 0.81,27.27
N$109  (via drill 0.6 pad 1.02)
  Top 0.203: 14.51,34.97 15.66,33.82 26.18,33.82 v26.63,33.37
  Top 0.305: LED1.A 14.51,34.97
  Bottom 0.203: 15.77,36.74 15.77,35.44 16.51,34.71 25.29,34.71 v26.63,33.37
  Bottom 0.305: 15.77,36.74 R2(560).1
(copper drawn outside any net)
  shapes: Top area x2